# Altium schematic sheet Current_meas.SchDoc
size A
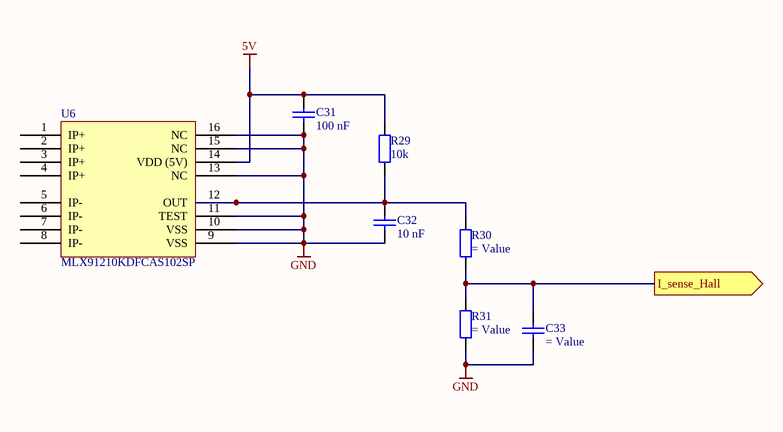
[diagram p0: Current_meas.SchDoc]

## Parts
C31  100 nF  [0805_C]
C32  10 nF  [0805_C]
C33  (no value)  [0805_C]
R29  10k
R30  (no value)
R31  (no value)
U6  MLX91210KDFCAS102SP  [SO-16Wide]

## Ports
I_sense_Hall (out)

## Nets
5V: C31.1 R29.2 U6.14(VDD_(5V))
GND: C31.2 C32.2 C33.2 R31.1 U6.9(VSS) U6.10(VSS) U6.11(TEST) U6.13(NC) U6.15(NC) U6.16(NC)
I_sense_Hall: C33.1 R30.1 R31.2 ; port I_sense_Hall
NetC32_1: C32.1 R29.1 R30.2 U6.12(OUT)

Not connected (* = marked no-connect by the designer): U6 1(IP+) 2(IP+) 3(IP+) 4(IP+) 5(IP-) 6(IP-) 7(IP-) 8(IP-)

## Library data of the parts
C31-C33 = CAP 0805
R29-R31 = RES 0805
U6 = MLX91210KDFCAS102SP: Board Mount Current Sensors Plug & Power Current Sensor IC in SOIC16 Wide Body - 2.5kV Isolation - Analog Output; ComponentLink1Description: Mouser.com; ComponentLink1URL: https://hu.mouser.com/ProductDetail/Melexis/MLX91210KDF-CAS-102-SP?qs=sGAEpiMZZMsPYxdnOoPGemLl7nQAULv2QUeSAaYcumeth6EpIS7pzA%3d%3d